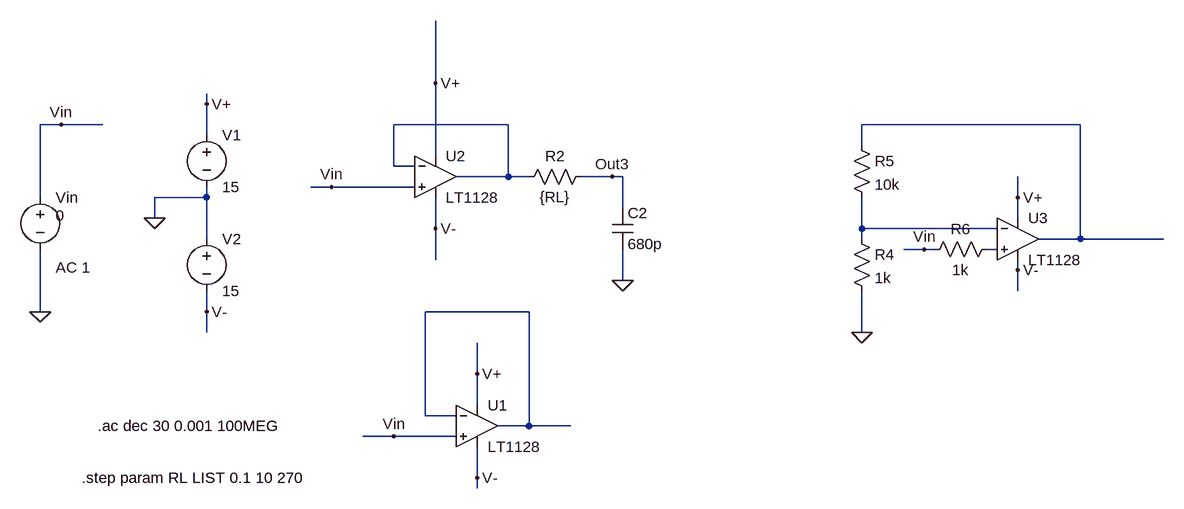
[diagram p0: schematic VoltageFollower.asc]
VoltageFollower.asc, the LTspice schematic file:
Version 4
SHEET 1 2148 744
WIRE 896 48 896 -48
WIRE 544 80 544 64
WIRE 320 112 288 112
WIRE 384 112 320 112
WIRE 1008 112 832 112
WIRE 1888 112 1552 112
WIRE 544 128 544 80
WIRE 1552 144 1552 112
WIRE 896 160 896 48
WIRE 832 176 832 112
WIRE 864 176 832 176
WIRE 1008 192 1008 112
WIRE 1008 192 928 192
WIRE 1040 192 1008 192
WIRE 1168 192 1120 192
WIRE 1184 192 1168 192
WIRE 736 208 704 208
WIRE 864 208 736 208
WIRE 288 224 288 112
WIRE 544 224 544 208
WIRE 544 224 464 224
WIRE 1792 224 1792 192
WIRE 1184 240 1184 192
WIRE 464 256 464 224
WIRE 1792 256 1792 224
WIRE 896 272 896 224
WIRE 1552 272 1552 224
WIRE 1760 272 1552 272
WIRE 544 288 544 224
WIRE 1552 288 1552 272
WIRE 1888 288 1888 112
WIRE 1888 288 1824 288
WIRE 2016 288 1888 288
WIRE 1648 304 1616 304
WIRE 1664 304 1648 304
WIRE 1760 304 1744 304
WIRE 896 320 896 272
WIRE 1792 336 1792 320
WIRE 1184 352 1184 304
WIRE 1792 368 1792 336
WIRE 288 400 288 304
WIRE 544 400 544 368
WIRE 1040 400 880 400
WIRE 544 432 544 400
WIRE 1552 432 1552 368
WIRE 960 496 960 448
WIRE 960 544 960 496
WIRE 880 560 880 400
WIRE 928 560 880 560
WIRE 1040 576 1040 400
WIRE 1040 576 992 576
WIRE 1104 576 1040 576
WIRE 832 592 784 592
WIRE 928 592 832 592
WIRE 960 656 960 608
WIRE 960 672 960 656
FLAG 288 400 0
FLAG 320 112 Vin
FLAG 1184 352 0
FLAG 736 208 Vin
FLAG 1168 192 Out3
FLAG 1792 224 V+
FLAG 896 272 V-
FLAG 1792 336 V-
FLAG 1552 432 0
FLAG 1648 304 Vin
FLAG 464 256 0
FLAG 544 400 V-
FLAG 544 80 V+
FLAG 896 48 V+
FLAG 960 656 V-
FLAG 960 496 V+
FLAG 832 592 Vin
SYMBOL voltage 288 208 R0
WINDOW 123 24 124 Left 2
WINDOW 39 0 0 Left 2
WINDOW 3 24 44 Left 2
SYMATTR Value2 AC 1
SYMATTR InstName Vin
SYMATTR Value 0
SYMBOL cap 1168 240 R0
SYMATTR InstName C2
SYMATTR Value 680p
SYMBOL res 1024 208 R270
WINDOW 0 32 56 VTop 2
WINDOW 3 0 56 VBottom 2
SYMATTR InstName R2
SYMATTR Value {RL}
SYMBOL Opamps\\LT1128 896 128 R0
SYMATTR InstName U2
SYMBOL res 1536 272 R0
SYMATTR InstName R4
SYMATTR Value 1k
SYMBOL res 1536 128 R0
SYMATTR InstName R5
SYMATTR Value 10k
SYMBOL res 1760 288 R90
WINDOW 0 0 56 VBottom 2
WINDOW 3 32 56 VTop 2
SYMATTR InstName R6
SYMATTR Value 1k
SYMBOL voltage 544 112 R0
SYMATTR InstName V1
SYMATTR Value 15
SYMBOL voltage 544 272 R0
SYMATTR InstName V2
SYMATTR Value 15
SYMBOL Opamps\\LT1128 960 512 R0
SYMATTR InstName U1
SYMBOL Opamps\\LT1128 1792 224 R0
SYMATTR InstName U3
TEXT 376 576 Left 2 !.ac dec 30 0.001 100MEG
TEXT 352 656 Left 2 !.step param RL LIST 0.1 10 270

The netlist it stands for:
* VoltageFollower.asc
Vin Vin 0 0 AC 1
C2 Out3 0 680p
R2 N001 Out3 {RL}
XU2 Vin N001 V+ V- N001 LT1128  ; pins In+ In- V+ V- OUT
R4 N003 0 1k
R5 N002 N003 10k
R6 N004 Vin 1k
V1 V+ 0 15
V2 0 V- 15
XU1 Vin N005 V+ V- N005 LT1128  ; pins In+ In- V+ V- OUT
XU3 N004 N003 V+ V- N002 LT1128  ; pins In+ In- V+ V- OUT
.ac dec 30 0.001 100MEG
.step param RL LIST 0.1 10 270
.lib LTC.lib
.backanno
.end